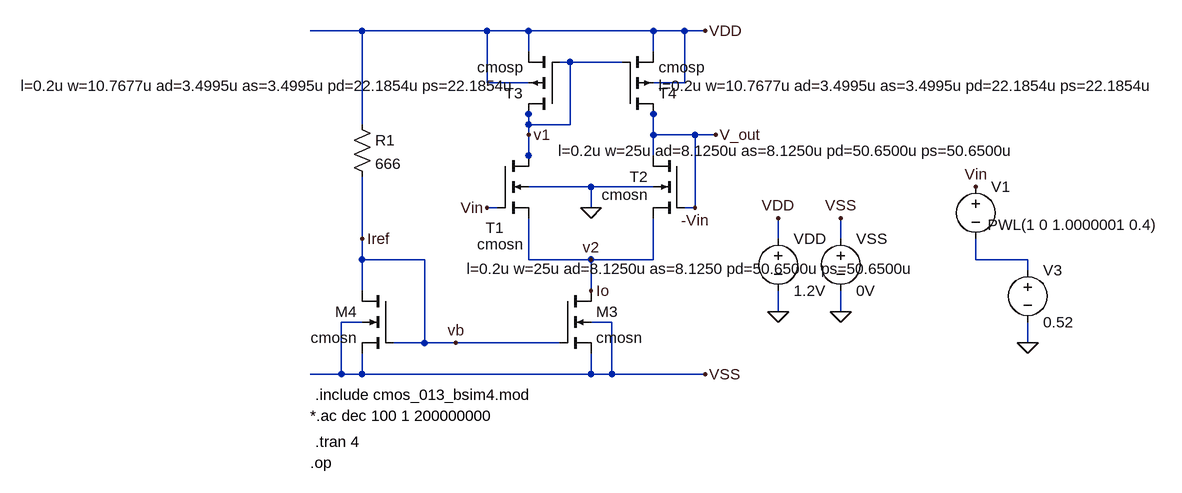
[diagram p0: schematic settling_time_differential_pair.asc]
settling_time_differential_pair.asc, the LTspice schematic file:
Version 4
SHEET 1 1616 816
WIRE 256 16 176 16
WIRE 448 16 256 16
WIRE 512 16 448 16
WIRE 704 16 512 16
WIRE 752 16 704 16
WIRE 784 16 752 16
WIRE 512 48 512 16
WIRE 704 48 704 16
WIRE 576 64 560 64
WIRE 656 64 576 64
WIRE 448 96 448 16
WIRE 512 96 448 96
WIRE 752 96 752 16
WIRE 752 96 704 96
WIRE 512 144 512 128
WIRE 704 144 704 128
WIRE 256 160 256 16
WIRE 512 160 512 144
WIRE 576 160 576 64
WIRE 576 160 512 160
WIRE 512 176 512 160
WIRE 704 176 704 144
WIRE 768 176 704 176
WIRE 800 176 768 176
WIRE 512 208 512 176
WIRE 704 208 704 176
WIRE 512 224 512 208
WIRE 608 256 512 256
WIRE 704 256 608 256
WIRE 464 288 448 288
WIRE 608 288 608 256
WIRE 768 288 768 176
WIRE 768 288 752 288
WIRE 256 336 256 240
WIRE 896 336 896 304
WIRE 992 336 992 304
WIRE 256 368 256 336
WIRE 352 368 256 368
WIRE 512 368 512 304
WIRE 608 368 512 368
WIRE 704 368 704 304
WIRE 704 368 608 368
WIRE 1200 368 1200 336
WIRE 1280 368 1200 368
WIRE 1280 384 1280 368
WIRE 256 416 256 368
WIRE 608 416 608 368
WIRE 896 448 896 416
WIRE 992 448 992 416
WIRE 256 464 224 464
WIRE 640 464 608 464
WIRE 352 496 352 368
WIRE 352 496 304 496
WIRE 400 496 352 496
WIRE 560 496 400 496
WIRE 1280 496 1280 464
WIRE 224 544 224 464
WIRE 224 544 176 544
WIRE 256 544 256 512
WIRE 256 544 224 544
WIRE 608 544 608 512
WIRE 608 544 256 544
WIRE 640 544 640 464
WIRE 640 544 608 544
WIRE 784 544 640 544
FLAG 784 16 VDD
FLAG 896 448 0
FLAG 896 304 VDD
FLAG 800 176 V_out
FLAG 784 544 VSS
FLAG 992 448 0
FLAG 992 304 VSS
FLAG 768 288 -Vin
FLAG 448 288 Vin
FLAG 1200 256 Vin
FLAG 512 176 v1
FLAG 608 368 v2
FLAG 400 496 vb
FLAG 256 336 Iref
FLAG 608 416 Io
FLAG 1280 496 0
FLAG 608 288 0
SYMBOL nmos4 752 208 M0
WINDOW 3 56 60 Left 2
WINDOW 123 -518 -8 Left 2
SYMATTR Value cmosn
SYMATTR Value2 l=0.2u w=25u ad=8.1250u as=8.1250u pd=50.6500u ps=50.6500u
SYMATTR InstName T2
SYMBOL nmos4 464 208 R0
WINDOW 0 -18 111 Left 2
WINDOW 3 -31 136 Left 2
WINDOW 123 -47 174 Left 2
SYMATTR InstName T1
SYMATTR Value cmosn
SYMATTR Value2 l=0.2u w=25u ad=8.1250u as=8.1250 pd=50.6500u ps=50.6500u
SYMBOL pmos4 656 144 M180
WINDOW 123 56 44 Left 2
SYMATTR Value2 l=0.2u w=10.7677u ad=3.4995u as=3.4995u pd=22.1854u ps=22.1854u
SYMATTR InstName T4
SYMATTR Value cmosp
SYMBOL pmos4 560 144 R180
WINDOW 123 56 44 Left 2
SYMATTR Value2 l=0.2u w=10.7677u ad=3.4995u as=3.4995u pd=22.1854u ps=22.1854u
SYMATTR InstName T3
SYMATTR Value cmosp
SYMBOL voltage 896 320 R0
SYMATTR InstName VDD
SYMATTR Value 1.2V
SYMBOL voltage 992 320 R0
SYMATTR InstName VSS
SYMATTR Value 0V
SYMBOL voltage 1200 240 R0
WINDOW 123 11 47 Left 2
WINDOW 39 0 0 Left 0
WINDOW 3 18 74 Left 2
SYMATTR Value PWL(1 0 1.0000001 0.4)
SYMATTR InstName V1
SYMBOL nmos4 560 416 R0
SYMATTR InstName M3
SYMATTR Value cmosn
SYMATTR Value2 l=0.26051u w=20u ad=6.5000u as=6.5000u pd=40.6500u ps=40.6500u
SYMBOL nmos4 304 416 M0
SYMATTR InstName M4
SYMATTR Value cmosn
SYMATTR Value2 l=0.26051u w=0.195u ad=0.0634u as=0.0634u pd=1.0400u ps=1.0400u
SYMBOL res 240 144 R0
SYMATTR InstName R1
SYMATTR Value 666
SYMBOL voltage 1280 368 R0
SYMATTR InstName V3
SYMATTR Value 0.52
TEXT 176 608 Left 2 !*.ac dec 100 1 200000000
TEXT 184 576 Left 2 !.include cmos_013_bsim4.mod
TEXT 176 680 Left 2 !.op
TEXT 184 648 Left 2 !.tran 4

The netlist it stands for:
* settling_time_differential_pair.asc
M§T2 -Vin -Vin Io 0 cmosn l=0.2u w=25u ad=8.1250u as=8.1250u pd=50.6500u ps=50.6500u
M§T1 v1 Vin Io 0 cmosn l=0.2u w=25u ad=8.1250u as=8.1250 pd=50.6500u ps=50.6500u
M§T4 -Vin v1 VDD VDD cmosp l=0.2u w=10.7677u ad=3.4995u as=3.4995u pd=22.1854u ps=22.1854u
M§T3 v1 v1 VDD VDD cmosp l=0.2u w=10.7677u ad=3.4995u as=3.4995u pd=22.1854u ps=22.1854u
VDD VDD 0 1.2V
VSS VSS 0 0V
V1 Vin N001 PWL(1 0 1.0000001 0.4)
M3 Io Iref VSS VSS cmosn l=0.26051u w=20u ad=6.5000u as=6.5000u pd=40.6500u ps=40.6500u
M4 Iref Iref VSS VSS cmosn l=0.26051u w=0.195u ad=0.0634u as=0.0634u pd=1.0400u ps=1.0400u
R1 VDD Iref 666
V3 N001 0 0.52
.model NMOS NMOS
.model PMOS PMOS
.lib standard.mos
*.ac dec 100 1 200000000
.include cmos_013_bsim4.mod
.op
.tran 4
.backanno
.end